# EasyEDA Pro project 【数字电位器】AD5293.eprj

# Schematic SCH_AD5293数字电位器
Create Date: 2024-05-11; Page Name: P1; Project Name: 【数字电位器】AD5293; Schematic Name: SCH_AD5293数字电位器; Update Date: 2024-05-11; Company: 嘉立创EDA; Page Size: A4; Version: V1.0
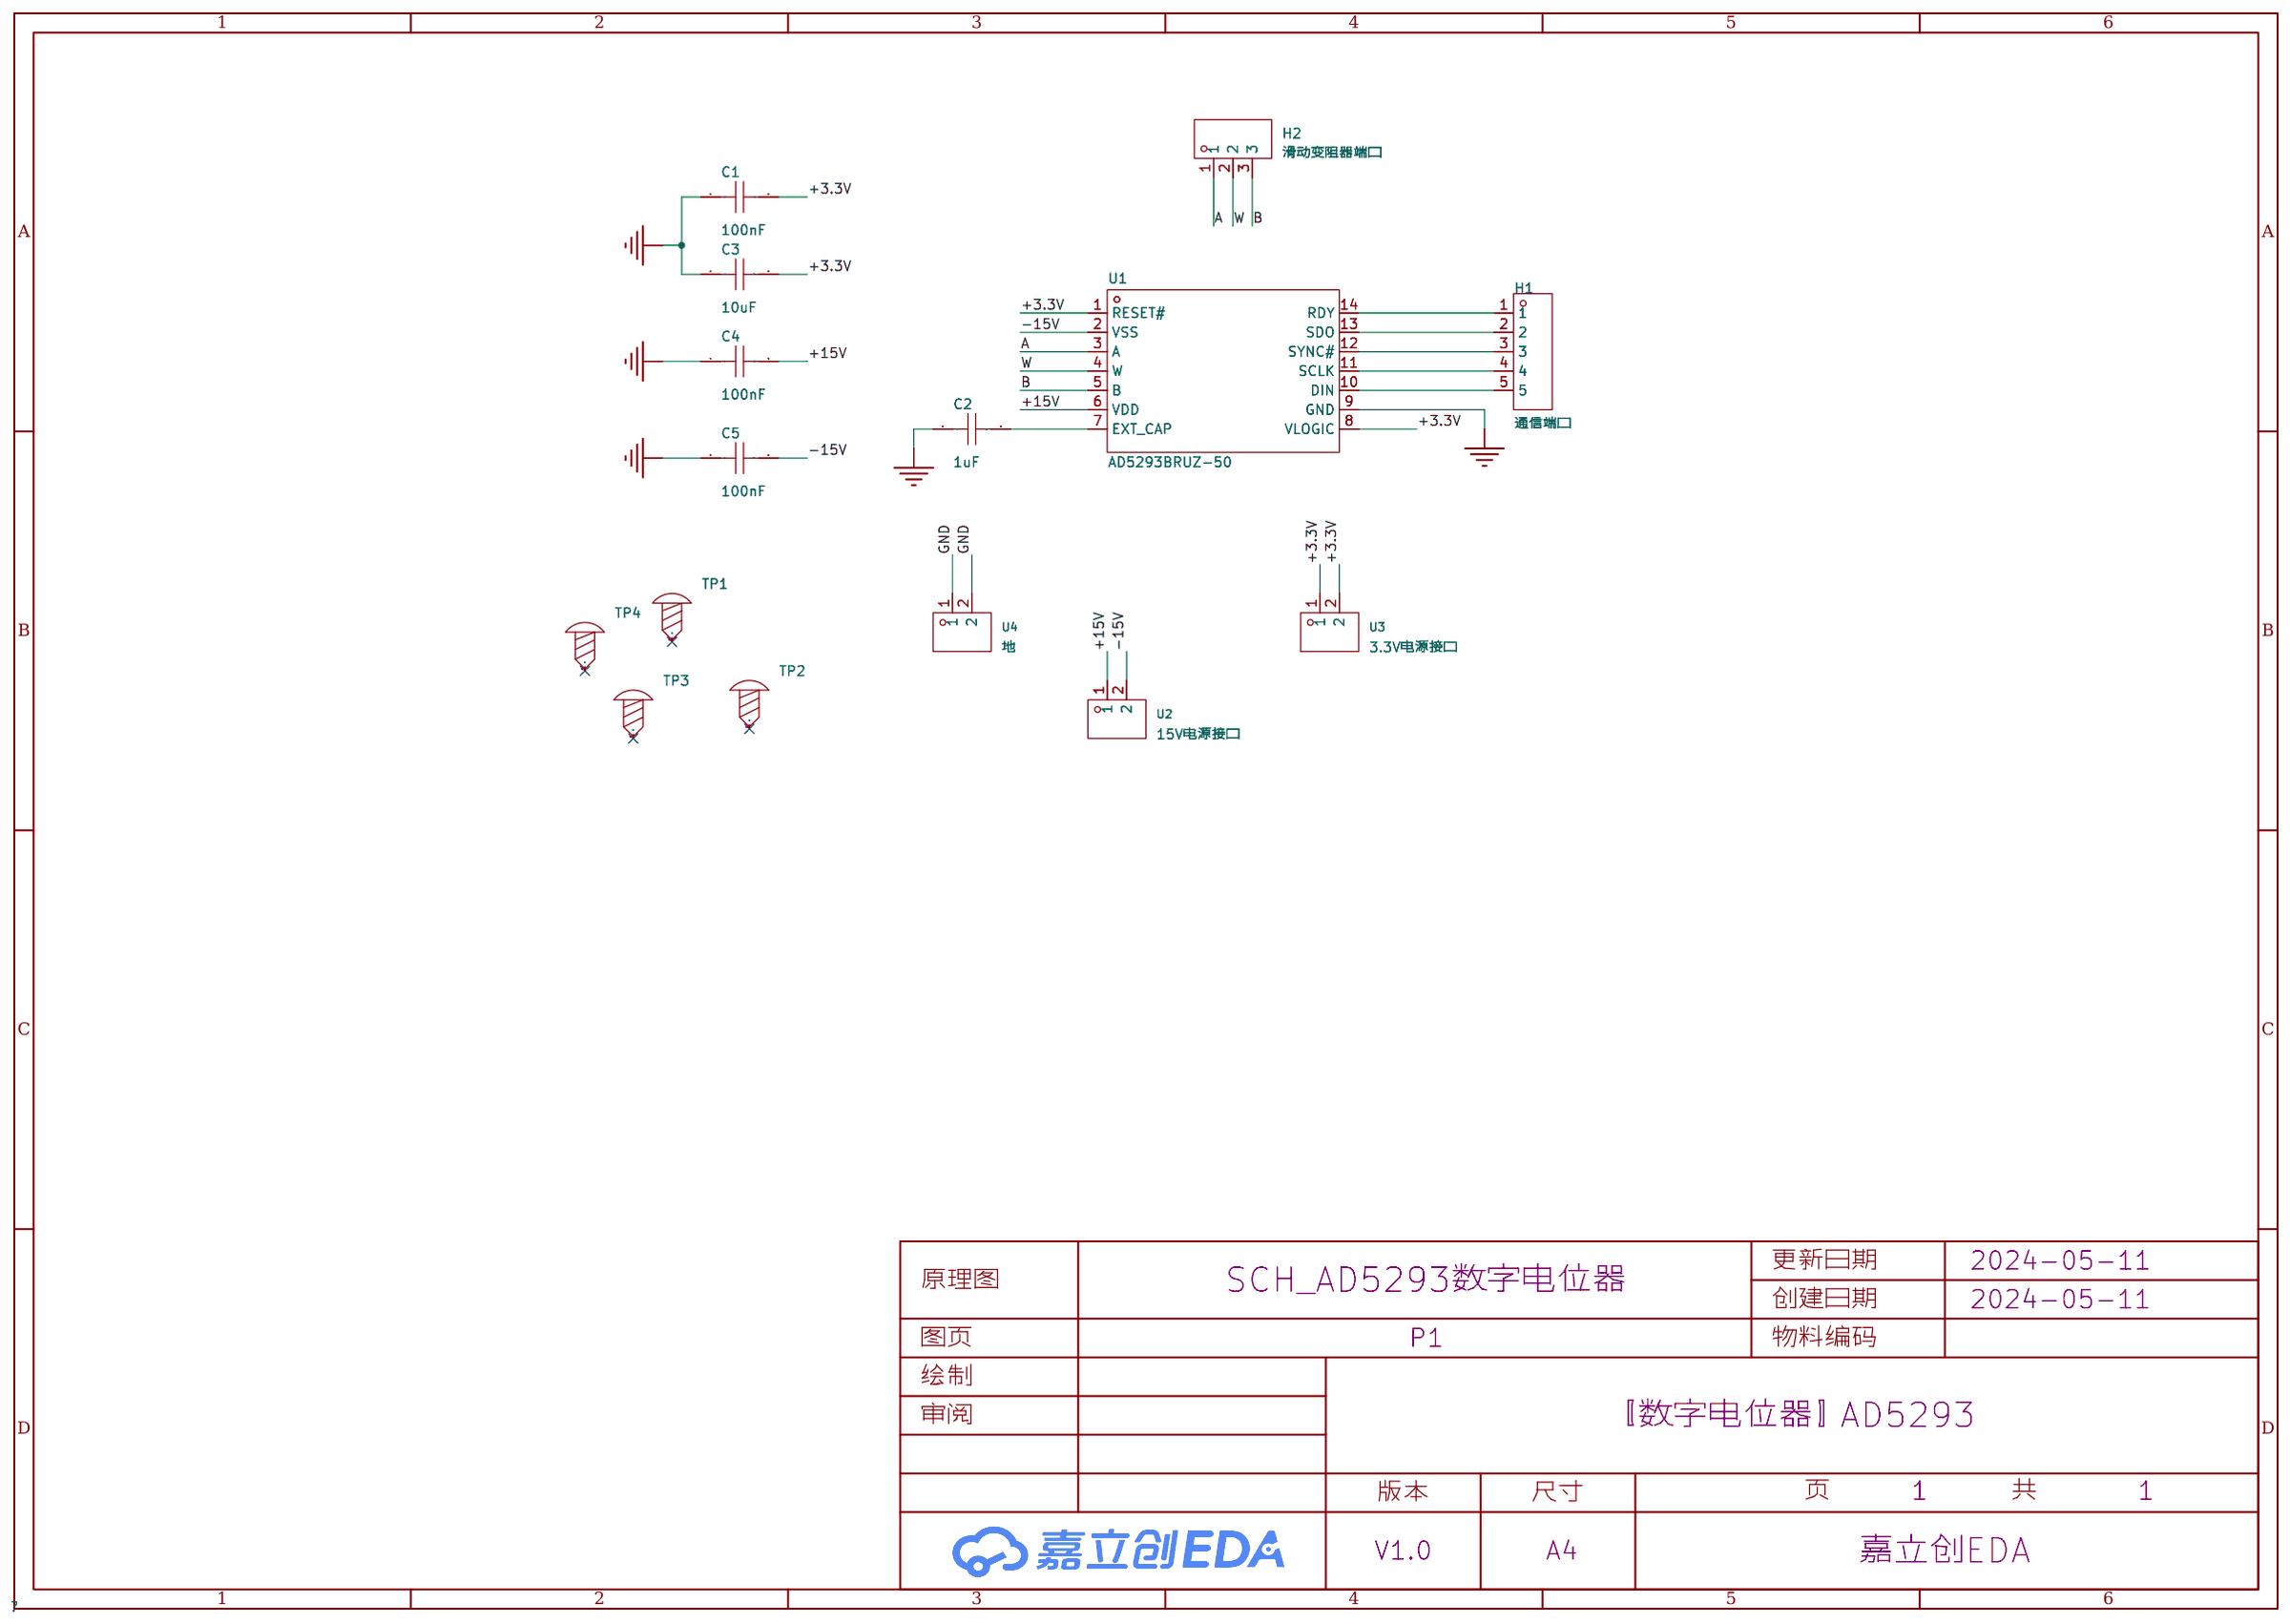
[diagram p0: schematic sheet]

## Parts
C1  100nF  [C0603]
C2  1uF  [C0603]
C3  10uF  [C0805]
C4  100nF  [C0603]
C5  100nF  [C0603]
H1  通信端口  [HDR-TH_5P-P2.54-V-M]
H2  滑动变阻器端口  [HDR-TH_3P-P2.54-V-M]
TP1  -  [M3螺丝]
TP2  -  [M3螺丝]
TP3  -  [M3螺丝]
TP4  -  [M3螺丝]
U1  AD5293BRUZ-50  [TSSOP-14_L5.0-W4.4-P0.65-LS6.4-BL]
U2  15V电源接口  [HDR-TH_2P-P2.54-V-M]
U3  3.3V电源接口  [HDR-TH_2P-P2.54-V-M]
U4  地  [HDR-TH_2P-P2.54-V-M]

## Library data of the parts
C1 C4 C5 = CC0603KRX7R9BB104: 容值:100nF;精度:±10%;额定电压:50V;材质(温度系数):X7R;; LCSC Part Name: 100nF ±10% 50V; Supplier Part: C14663; Manufacturer: YAGEO(国巨); Supplier Footprint: 0603; JLCPCB Part Class: Basic Part; Datasheet: https://atta.szlcsc.com/upload/public/pdf/source/20180910/C282072_33301C7F631E79921B82A8DAC6BCC5B3.pdf; Supplier: LCSC; Tolerance: ±10%; Voltage Rated: 50V; Temperature Coefficient: X7R
C2 = CL10A105KB8NNNC: 容值:1uF;精度:±10%;额定电压:50V;材质(温度系数):X5R;; LCSC Part Name: 1uF ±10% 50V; Supplier Part: C15849; Manufacturer: SAMSUNG(三星); Supplier Footprint: 0603; JLCPCB Part Class: Basic Part; Datasheet: https://atta.szlcsc.com/upload/public/pdf/source/20160218/1457707763339.pdf; Supplier: LCSC; Tolerance: ±10%; Voltage Rated: 50V; Temperature Coefficient: X5R
C3 = CL21A106KOQNNNE: 容值:10uF;精度:±10%;额定电压:16V;材质(温度系数):X5R;; LCSC Part Name: 10uF ±10% 16V; Supplier Part: C1713; Manufacturer: SAMSUNG(三星); Supplier Footprint: 0805; JLCPCB Part Class: Extended Part; Datasheet: https://atta.szlcsc.com/upload/public/pdf/source/20160218/1457707763339.pdf; Supplier: LCSC; Tolerance: ±10%; Voltage Rated: 16V; Temperature Coefficient: X5R
H1 = KH-2.54PH180-1X5P-L11.5: 插针结构:1x5P;间距:2.54mm;行距:-;圆针/方针:方针;安装类型:直插;排数:单排;总PIN位数:5P;额定电流:3A;额定电压:-;配合针长度:6mm;塑高:2.5mm;端接针长度:3mm;工作温度范围:-40℃~+105℃;颜色:黑色;; LCSC Part Name: 间距:2.54mm 1x5P 直插 方针; Supplier Part: C2932699; Manufacturer: kinghelm(金航标); Supplier Footprint: 插件,P=2.54mm; JLCPCB Part Class: 扩展库; Datasheet: https://atta.szlcsc.com/upload/public/pdf/source/20211220/226CF9663F50C56A6910C5061F0E2217.pdf; Supplier: LCSC; Pin Structure: 1x5P; Pitch: 2.54mm; Circluar Pins/Square Pins: 方针; Mounting Type: 直插; Number of Rows: 单排; Number of Pins: 5P; Current Rating (Max): 3A; Length of Mating Pin: 6mm; Insulation Height: 2.5mm; Length of End Connection Pin: 3mm; Operating Temperature Range: -40℃~+105℃; Color: 黑色
H2 = KH-2.54PH180-1X3P-L11.5: 插针结构:1x3P;间距:2.54mm;行距:-;圆针/方针:方针;安装类型:直插;排数:单排;总PIN位数:3P;额定电流:3A;额定电压:-;配合针长度:6mm;塑高:2.5mm;端接针长度:3mm;工作温度范围:-40℃~+105℃;颜色:黑色;; LCSC Part Name: 间距:2.54mm 1x3P 直插 方针; Supplier Part: C2932698; Manufacturer: kinghelm(金航标); Supplier Footprint: 插件,P=2.54mm; JLCPCB Part Class: 扩展库; Datasheet: https://atta.szlcsc.com/upload/public/pdf/source/20211220/D2AB060C07EA7DD91A5B4AA994AB98CA.pdf; Supplier: LCSC; Pin Structure: 1x3P; Pitch: 2.54mm; Circluar Pins/Square Pins: 方针; Mounting Type: 直插; Number of Rows: 单排; Number of Pins: 3P; Current Rating (Max): 3A; Length of Mating Pin: 6mm; Insulation Height: 2.5mm; Length of End Connection Pin: 3mm; Operating Temperature Range: -40℃~+105℃; Color: 黑色
TP1-TP4 = M3螺丝: Supplier Footprint: 插件
U1 = AD5293BRUZ-50: 电阻值(欧姆):50kΩ;接口类型:SPI;供电电压:9V~33V；9V~16.5V;精度:±1%;; Supplier Part: C578171; Manufacturer: ADI(亚德诺); Supplier Footprint: TSSOP-14; JLCPCB Part Class: 扩展库; Datasheet: https://atta.szlcsc.com/upload/public/pdf/source/20191107/C444343_72C0CFD5AA682EBBEECAED25CA2DA891.pdf; Supplier: LCSC; Resistance Value (Ohms): 50kΩ; Number of Taps: 1024; Interface Type: SPI; Number of Channels: 1; Supply Voltage: 9V~33V；9V~16.5V; Precision: ±1%; Temperature Coefficient (Typ): 35ppm/℃; Operating Temperature: -40℃~+105℃
U2-U4 = GPHA101-0202A001A1BA: 插针结构:1x2P;间距:2.54mm;行距:2.54mm;圆针/方针:方针;安装类型:直插;排数:单排;总PIN位数:2P;额定电流:3A;工作温度范围:-40℃~+105℃;; LCSC Part Name: 1x2P 间距:2.54mm 方针 直插; Supplier Part: C7434479; Manufacturer: GREENCONN(格康); Supplier Footprint: 插件,P=2.54mm; Datasheet: https://atta.szlcsc.com/upload/public/pdf/source/20230629/29B861B43DC477A011ED023B9618EA31.pdf; Supplier: LCSC; Pin Structure: 1x2P; Pitch: 2.54mm; Row Spacing: 2.54mm; Circluar Pins/Square Pins: 方针; Mounting Type: 直插; Number of Rows: 单排; Number of Pins: 2P; Current Rating (Max): 3A; Operating Temperature Range: -40℃~+105℃

## Nets
+3.3V: C1.2 C3.2 U1.1(RESET#) U1.8(VLOGIC) U3.1 U3.2
+15V: C4.2 U1.6(VDD) U2.1
-15V: C5.2 U1.2(VSS) U2.2
GND: C1.1 C2.1 C3.1 C4.1 C5.1 U1.9(GND) U4.1 U4.2
A: H2.1 U1.3(A)
B: H2.3 U1.5(B)
W: H2.2 U1.4(W)
$1N851: H1.5 U1.10(DIN)
$1N856: H1.4 U1.11(SCLK)
$1N861: H1.3 U1.12(SYNC#)
$1N866: H1.2 U1.13(SDO)
$1N871: H1.1 U1.14(RDY)
$1N1342: C2.2 U1.7(EXT_CAP)

Not connected (* = marked no-connect by the designer): TP1 1*; TP2 1*; TP3 1*; TP4 1*

# Board PCB_AD5293数字电位器
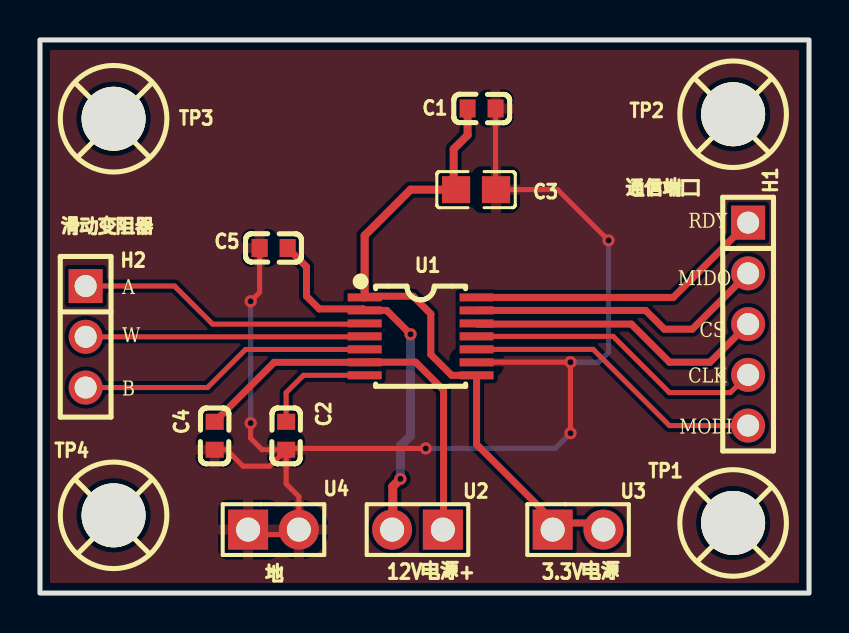
[diagram p1: board, top side]
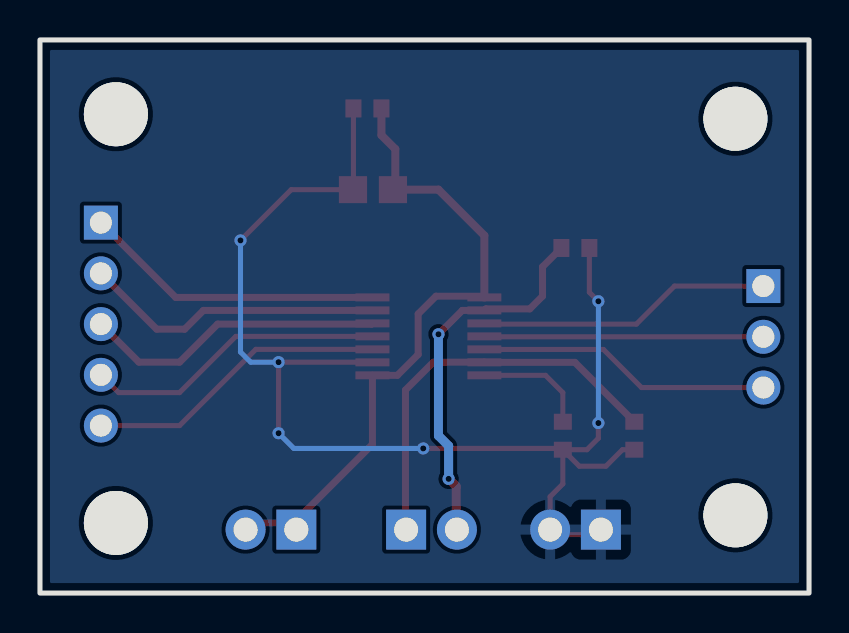
[diagram p2: board, bottom side, seen from below]

Outline 38.48 x 27.69 mm; copper layers: Top Layer, Bottom Layer. Coordinates in mm from the lower left corner of the outline.
Outline path: rectangle 0,27.69 38.48,0
Stack: Top Layer 0.035mm / Dielectric1 1.51mm FR4 er 4.5 / Bottom Layer 0.035mm

## Design rules (mm)
template: JLCPCB Capability(Two Layers Board)
spacing copperThickness1oz (default): track to track 0.102, other pairs 0.152 to 0.3
spacing copperThickness2oz: track to track 0.203, other pairs 0.152 to 0.3
track width copperThickness1oz (default): min 0.127, default 0.254, max 2.54
track width copperThickness2oz: min 0.203, default 0.254, max 2.54
differential pair differentialPair (default): width min 0.127, default 0.254, max 2.54; gap min 0.152, default 0.152
via viaSize (default): diameter min 0.5, default 0.61, max 10; hole min 0.3, default 0.305, max 6.3

## Placement (name value [footprint] x y rotation side)
C1  100nF  [C0603]  22.1 24.26 180 top
C2  1uF  [C0603]  12.32 7.87 90 top
C3  10uF  [C0805]  21.82 20.19 180 top
C4  100nF  [C0603]  8.74 7.87 90 top
C5  100nF  [C0603]  11.69 17.27 0 top
H1  通信端口  [HDR-TH_5P-P2.54-V-M]  35.43 13.46 270 top
H2  滑动变阻器端口  [HDR-TH_3P-P2.54-V-M]  2.29 12.83 270 top
TP1  -  [M3螺丝]  34.75 3.45 0 top
TP2  -  [M3螺丝]  34.75 23.9 0 top
TP3  -  [M3螺丝]  3.75 23.68 0 top
TP4  -  [M3螺丝]  3.75 3.83 0 top
U1  AD5293BRUZ-50  [TSSOP-14_L5.0-W4.4-P0.65-LS6.4-BL]  19.05 12.85 270 top
U2  15V电源接口  [HDR-TH_2P-P2.54-V-M]  18.89 3.17 180 top
U3  3.3V电源接口  [HDR-TH_2P-P2.54-V-M]  26.92 3.17 0 top
U4  地  [HDR-TH_2P-P2.54-V-M]  11.68 3.17 0 top

## Footprints (pads in the part's own frame, mm; a bottom-side part is the same pattern mirrored in y, then rotated)
C0603
  rect 0.8x0.9 smd: 1(-0.7,0) 2(0.7,0)
C0805
  rect 1.41x1.35 smd: 1(-1,0) 2(1,0)
HDR-TH_2P-P2.54-V-M
  rect 2x2 hole 1.2: 1(-1.27,0)
  round 2 hole 1.2: 2(1.27,0)
HDR-TH_3P-P2.54-V-M
  rect 1.7x1.7 hole 1.1: 1(-2.54,0)
  round 1.7 hole 1.1: 2(0,0) 3(2.54,0)
HDR-TH_5P-P2.54-V-M
  rect 1.7x1.7 hole 1.1: 1(-5.08,0)
  round 1.7 hole 1.1: 2(-2.54,0) 3(0,0) 4(2.54,0) 5(5.08,0)
M3螺丝
  round 3.2 hole 3.2: 1(-0.064,0.064)
TSSOP-14_L5.0-W4.4-P0.65-LS6.4-BL
  rect 0.4x1.7 smd: 1(-1.95,-2.8) 2(-1.3,-2.8) 3(-0.65,-2.8) 4(0,-2.8) 5(0.65,-2.8) 6(1.3,-2.8) 7(1.95,-2.8) 8(1.95,2.8) 9(1.3,2.8) 10(0.65,2.8) 11(0,2.8) 12(-0.65,2.8) 13(-1.3,2.8) 14(-1.95,2.8)

## Nets
As in the schematic.

Pads without a net: TP1 1; TP2 1; TP3 1; TP4 1

## Via types
v1: diameter 0.61, hole 0.305, Top Layer to Bottom Layer, 8 vias

## Routing (per net, layer and track width the routed paths; a pad name or vN(x,y) marks a point on that pad's centre or on a via; arc(x,y) is an arc through that point)
+3.3V: length 33
  Top Layer w0.35: 28.32,3.51 25.78,3.51 21.85,7.44 U1.8 20.6,10.9 19.56,11.94 19.56,13.97 18.67,14.86 16.31,14.86 U1.1
  Top Layer w0.4: U1.1 16.25,17.9 18.54,20.19 C3.2 20.7,20.31 20.7,22.22 21.4,22.92 C1.2
+15V: length 20.5
  Top Layer w0.35: C4.2 11.72,11.55 U1.6 16.25,11.56 18.8,11.56 20.19,10.16 20.19,2.92
-15V: length 19.2
  Top Layer w0.35: v1(18.54,12.95) 17.35,14.15 U1.2 16.17,14.22 13.97,14.22 13.34,14.86 13.34,16.33 C5.2
  Top Layer w0.45: 17.65,2.92 17.65,5.33 v1(18.03,5.72)
  Bottom Layer w0.45: v1(18.03,5.72) 18.03,7.37 18.54,7.87 v1(18.54,12.95)
GND: length 64.3
  Top Layer w0.254: C5.1 10.99,15.06 v1(10.54,14.61) ; C1.1 22.8,20.22 C3.1 25.91,20.19 v1(28.45,17.65) ; C2.1 12.32,5.46 12.95,4.83 12.95,2.92 10.41,2.92 ; C2.1 11.5,6.35 10.16,6.35 9.34,7.17 C4.1 ; C2.1 12.38,7.24 v1(19.3,7.24) ; C2.1 11.11,7.17 10.54,7.75 v1(10.54,8.51) ; U1.9 21.85,11.56 v1(26.54,11.56) v1(26.54,8)
  Bottom Layer w0.254: v1(26.54,8) 25.78,7.24 v1(19.3,7.24) ; v1(26.54,11.56) 27.94,11.56 28.45,12.06 v1(28.45,17.65) ; v1(10.54,14.61) v1(10.54,8.51)
A: length 14.8
  Top Layer w0.254: H2.1 6.73,15.37 8.64,13.46 16.21,13.46 U1.3
B: length 14.8
  Top Layer w0.254: 2.29,10.29 8.38,10.29 10.29,12.19 16.24,12.19 U1.5
W: length 14
  Top Layer w0.254: U1.4 16.22,12.83 H2.2
$1N851: length 15.2
  Top Layer w0.254: U1.10 27.68,12.2 31.5,8.38 H1.5
$1N856: length 15.1
  Top Layer w0.254: H1.4 34.54,10.03 31.5,10.03 28.68,12.85 U1.11
$1N861: length 15.2
  Top Layer w0.35: U1.12 21.88,13.46 29.59,13.46 31.5,11.56 33.53,11.56 H1.3
$1N866: length 15.1
  Top Layer w0.35: U1.13 30.3,14.15 31.24,13.21 32.64,13.21 H1.2
$1N871: length 15.1
  Top Layer w0.35: U1.14 31.69,14.8 H1.1
$1N1342: length 5.7
  Top Layer w0.254: U1.7 13.18,10.9 12.32,10.03 C2.2

## Copper pours and planes (outline as drawn; the poured copper is in the pictures)
GND on Top Layer: 0,27.69 38.48,27.69 38.48,0 0,0
GND on Bottom Layer: 0,27.69 38.48,27.69 38.48,0 0,0

## Text on the board
Top Silkscreen Layer: 滑动变阻器 | B | A | W | 地 | 12V电源+ | 3.3V电源 | 通信端口 | MIDO | MODI | CLK | RDY | CS
